# EAGLE design PCB-RPIBO1 (EAGLE 6.5.0)
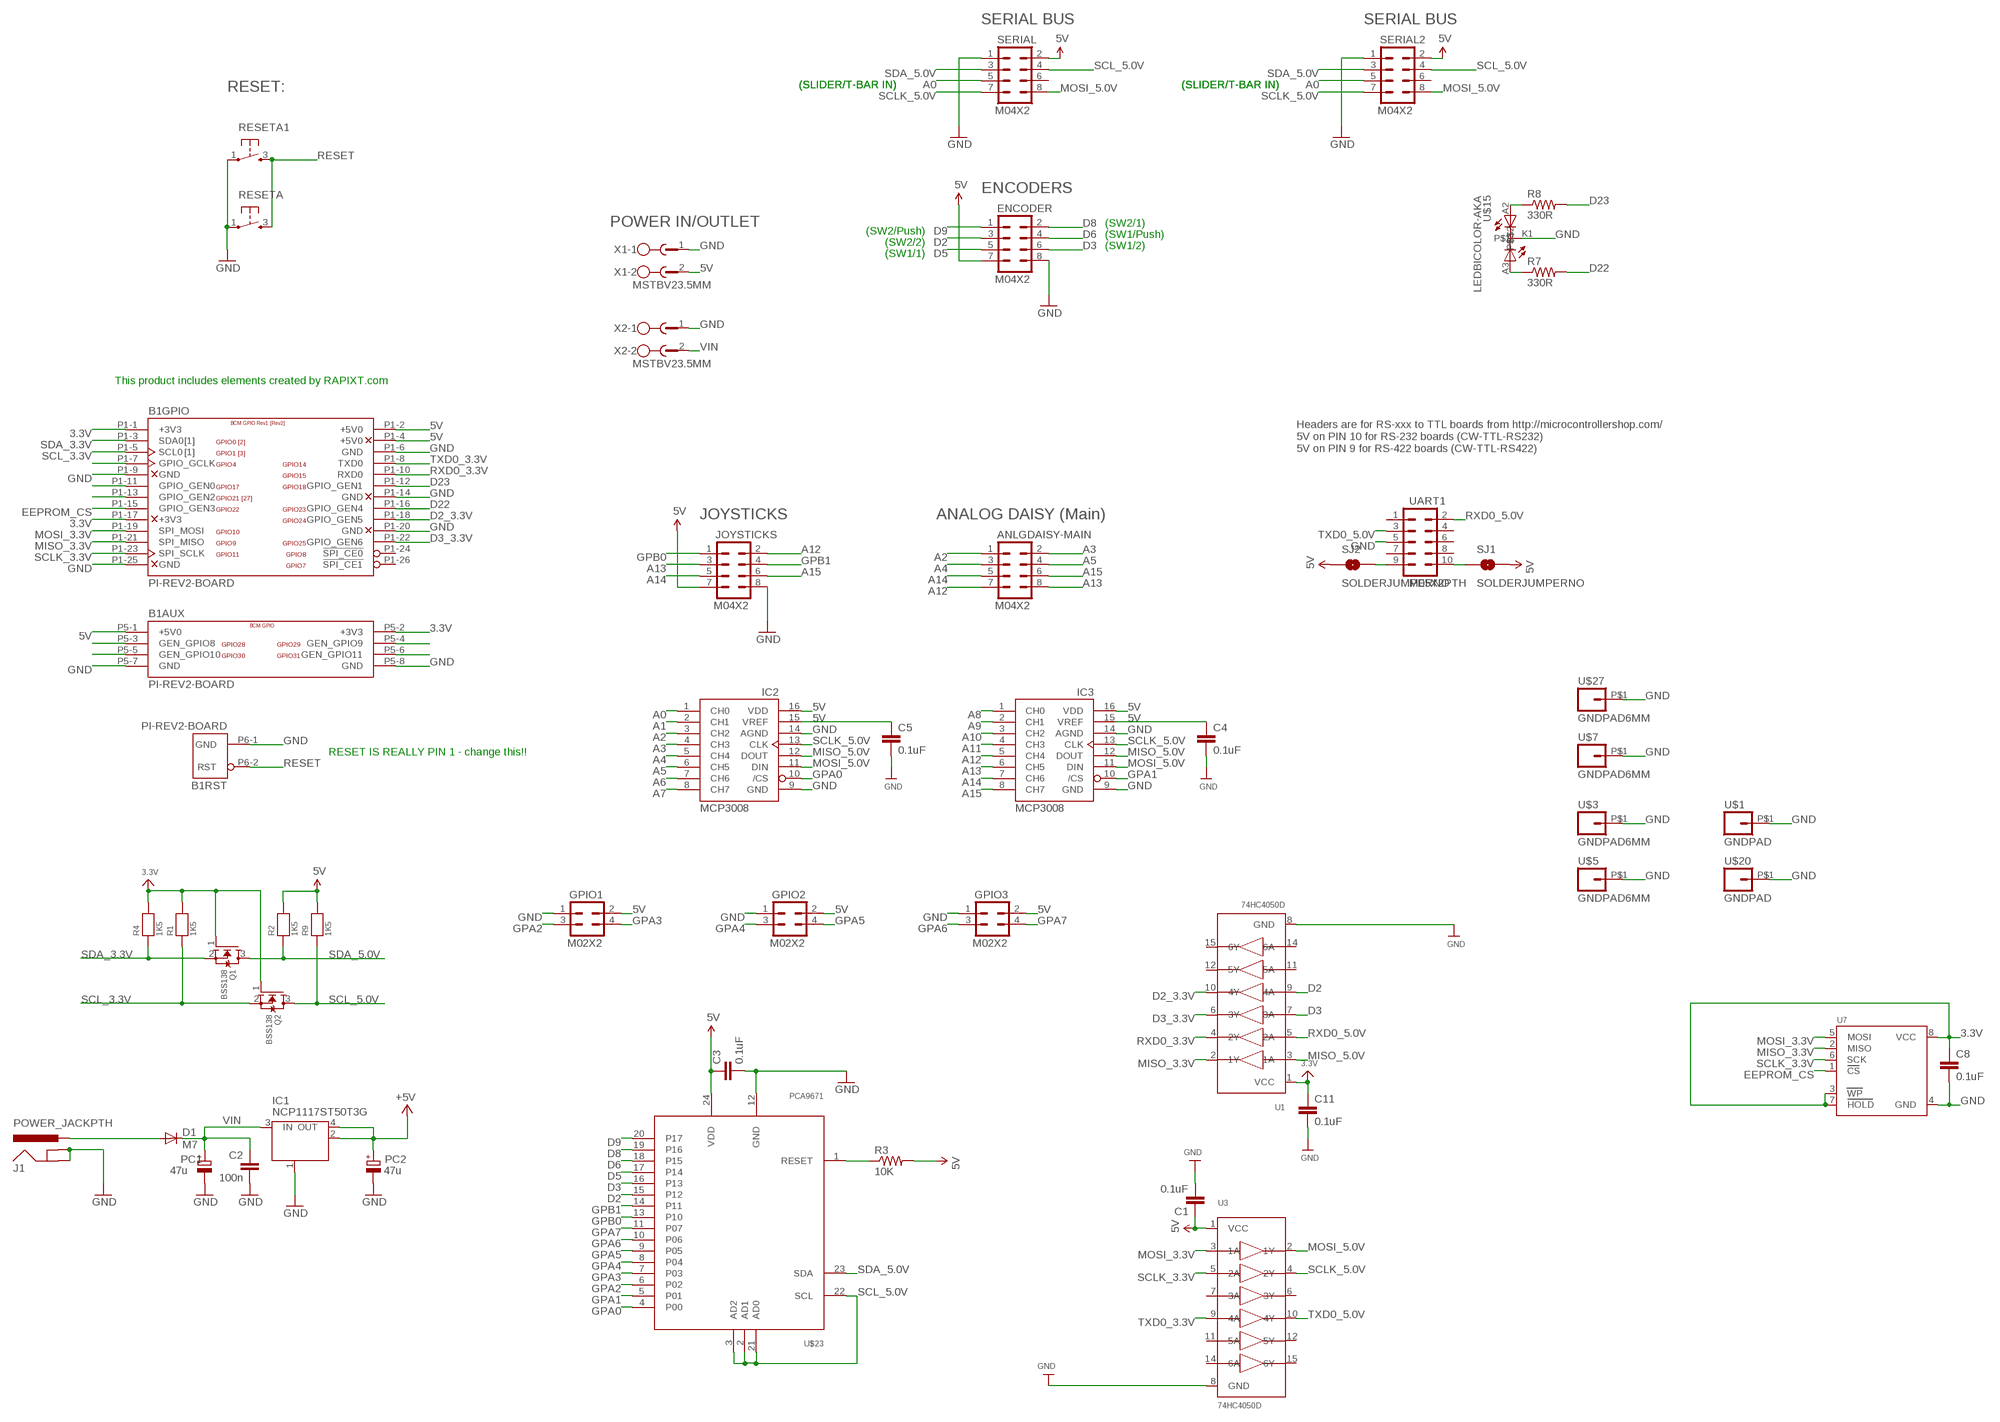
[diagram p0: schematic, sheet 1]

## Parts
ANLGDAISY-MAIN  M04X2  [2X4]
B1  PI-REV2-BOARD  [RASPBERRY-PI-REV2]
C1  0.1uF  CAP0603-CAP  [0603-CAP]
C2  100n  C-EU0603-RND  [C0603-ROUND]
C3  0.1uF  CAP0603-CAP  [0603-CAP]
C4  0.1uF  CAP0603-CAP  [0603-CAP]
C5  0.1uF  CAP0603-CAP  [0603-CAP]
C8  0.1uF  CAP0603-CAP  [0603-CAP]
C11  0.1uF  CAP0603-CAP  [0603-CAP]
D1  M7  DIODE-SMB  [SMB]
ENCODER  M04X2  [2X4]
GPIO1  M02X2  [2X2]
GPIO2  M02X2  [2X2]
GPIO3  M02X2  [2X2]
IC1  NCP1117ST50T3G  MC33269ST-3.3T3  [SOT223]
IC2  MCP3008SOIC  [SOIC16]
IC3  MCP3008SOIC  [SOIC16]
J1  POWER_JACKPTH  [POWER_JACK_PTH]
JOYSTICKS  M04X2  [2X4]
PC1  47u  CPOL-EUD  [PANASONIC_D]
PC2  47u  CPOL-EUD  [PANASONIC_D]
Q1  BSS138  MOSFET-NWIDE  [SOT23-WIDE]
Q2  BSS138  MOSFET-NWIDE  [SOT23-WIDE]
R1  1K5  RESISTOR0603  [0603]
R2  1K5  RESISTOR0603  [0603]
R3  10K  RESISTOR0603-RES  [0603-RES]
R4  1K5  RESISTOR0603  [0603]
R7  330R  RESISTOR0603-RES  [0603-RES]
R8  330R  RESISTOR0603-RES  [0603-RES]
R9  1K5  RESISTOR0603  [0603]
RESETA  TAC_SWITCH  [PUSHBUTTON]
RESETA1  TAC_SWITCH  [PUSHBUTTON]
SERIAL  M04X2  [2X4]
SERIAL2  M04X2  [2X4]
SJ1  SOLDERJUMPERNO  [SJ_2S-NO]
SJ2  SOLDERJUMPERNO  [SJ_2S-NO]
U1  74HC4050D  74HC4050DTSSOP16  [TSSOP16]
U3  74HC4050D  74HC4050DTSSOP16  [TSSOP16]
U7  EEPROM_SPI_AT25040ATSSOP  [TSSOP8-4.4MM]
U$1  GNDPAD  [3.2MMPAD]
U$3  GNDPAD6MM  [3.2MMPAD6MM]
U$5  GNDPAD6MM  [3.2MMPAD6MM]
U$7  GNDPAD6MM  [3.2MMPAD6MM]
U$15  LEDBICOLOR-AKA  [LED5MM-BICOLOR]
U$20  GNDPAD  [3.2MMPAD]
U$23  PCA9671  [TSSOP24]
U$27  GNDPAD6MM  [3.2MMPAD6MM]
UART1  M05X2PTH  [AVR_ICSP]
X1  MSTBV23.5MM  [MSTBV2-3.5]
X2  MSTBV23.5MM  [MSTBV2-3.5]

## Nets
3.3V [Power]: B1.P1-1(GPIO:+3V3) B1.P1-17(GPIO:+3V3) B1.P5-2(AUX:+3V3) C8.1 C11.1 Q1.1(G) Q2.1(G) R1.2 R4.2 U1.1(VCC) U7.3(WP) U7.7(HOLD) U7.8(VCC)
5V [Power]: B1.P1-2(GPIO:+5V0) B1.P1-4(GPIO:+5V0) B1.P5-1(AUX:+5V0) C1.1 C3.1 C4.1 C5.1 ENCODER.7 GPIO1.2 GPIO2.2 GPIO3.2 IC1.2(OUT) IC1.4(OUT) IC2.15(VREF) IC2.16(VDD) IC3.15(VREF) IC3.16(VDD) JOYSTICKS.7 PC2.+ R2.2 R3.2 R9.2 SERIAL2.2 SERIAL.2 SJ1.2 SJ2.1 U3.1(VCC) U$23.24(VDD) X1.2 ; supply symbol labelled +5V
12V [Power]: D1.A J1.PWR
A0: IC2.1(CH0) SERIAL2.5 SERIAL.5
A1: IC2.2(CH1)
A2: ANLGDAISY-MAIN.1 IC2.3(CH2)
A3: ANLGDAISY-MAIN.2 IC2.4(CH3)
A4: ANLGDAISY-MAIN.3 IC2.5(CH4)
A5: ANLGDAISY-MAIN.4 IC2.6(CH5)
A6: IC2.7(CH6)
A7: IC2.8(CH7)
A8: IC3.1(CH0)
A9: IC3.2(CH1)
A10: IC3.3(CH2)
A11: IC3.4(CH3)
A12: ANLGDAISY-MAIN.7 IC3.5(CH4) JOYSTICKS.2
A13: ANLGDAISY-MAIN.8 IC3.6(CH5) JOYSTICKS.3
A14: ANLGDAISY-MAIN.5 IC3.7(CH6) JOYSTICKS.5
A15: ANLGDAISY-MAIN.6 IC3.8(CH7) JOYSTICKS.6
D2: ENCODER.3 U1.9(4A) U$23.15(P12)
D2_3.3V: B1.P1-18(GPIO:GPIO_GEN5) U1.10(4Y)
D3: ENCODER.6 U1.7(3A) U$23.16(P13)
D3_3.3V: B1.P1-22(GPIO:GPIO_GEN6) U1.6(3Y)
D5: ENCODER.5 U$23.17(P14)
D6: ENCODER.4 U$23.18(P15)
D8: ENCODER.2 U$23.19(P16)
D9: ENCODER.1 U$23.20(P17)
D22: B1.P1-16(GPIO:GPIO_GEN4) R7.2
D23: B1.P1-12(GPIO:GPIO_GEN1) R8.2
EEPROM_CS: B1.P1-15(GPIO:GPIO_GEN3) U7.1(CS)
GND [Power]: B1.P1-6(GPIO:GND) B1.P1-9(GPIO:GND) B1.P1-14(GPIO:GND) B1.P1-20(GPIO:GND) B1.P1-25(GPIO:GND) B1.P5-7(AUX:GND) B1.P5-8(AUX:GND) B1.P6-1(RST:GND) C1.2 C2.2 C3.2 C4.2 C5.2 C8.2 C11.2 ENCODER.8 GPIO1.1 GPIO2.1 GPIO3.1 IC1.1(GND/ADJ) IC2.9(GND) IC2.14(AGND) IC3.9(GND) IC3.14(AGND) J1.GND J1.SHUNT(GNDBREAK) JOYSTICKS.8 PC1.- PC2.- RESETA1.1 RESETA.1 SERIAL2.1 SERIAL.1 U1.8(GND) U3.8(GND) U7.4(GND) U$1.P$1 U$3.P$1 U$5.P$1 U$7.P$1 U$15.K1 U$20.P$1 U$23.12(GND) U$27.P$1 UART1.5 X1.1 X2.1
GPA0: IC2.10(/CS) U$23.4(P00)
GPA1: IC3.10(/CS) U$23.5(P01)
GPA2: GPIO1.3 U$23.6(P02)
GPA3: GPIO1.4 U$23.7(P03)
GPA4: GPIO2.3 U$23.8(P04)
GPA5: GPIO2.4 U$23.9(P05)
GPA6: GPIO3.3 U$23.10(P06)
GPA7: GPIO3.4 U$23.11(P07)
GPB0: JOYSTICKS.1 U$23.13(P10)
GPB1: JOYSTICKS.4 U$23.14(P11)
MISO_3.3V: B1.P1-21(GPIO:SPI_MISO) U1.2(1Y) U7.2(MISO)
MISO_5.0V: IC2.12(DOUT) IC3.12(DOUT) U1.3(1A)
MOSI_3.3V: B1.P1-19(GPIO:SPI_MOSI) U3.3(1A) U7.5(MOSI)
MOSI_5.0V: IC2.11(DIN) IC3.11(DIN) SERIAL2.8 SERIAL.8 U3.2(1Y)
N$1: R3.1 U$23.1(RESET)
N$9: SJ2.2 UART1.9
N$10: SJ1.1 UART1.10
N$17: R8.1 U$15.A2
N$22: R7.1 U$15.A3
N$24: B1.P1-13(GPIO:GPIO_GEN2)
N$25: B1.P1-11(GPIO:GPIO_GEN0)
N$27: B1.P1-7(GPIO:GPIO_GCLK)
N$34: B1.P5-4(AUX:GEN_GPIO9)
N$35: B1.P5-6(AUX:GEN_GPIO11)
N$38: B1.P5-3(AUX:GEN_GPIO8)
N$39: B1.P5-5(AUX:GEN_GPIO10)
RESET: B1.P6-2(RST:RST) RESETA1.3 RESETA.3
RXD0_3.3V: B1.P1-10(GPIO:RXD0) U1.4(2Y)
RXD0_5.0V: U1.5(2A) UART1.2
SCL_3.3V: B1.P1-5(GPIO:SCL0) Q2.2(S) R1.1
SCL_5.0V: Q2.3(D) R9.1 SERIAL2.4 SERIAL.4 U$23.2(AD1) U$23.3(AD2) U$23.21(AD0) U$23.22(SCL)
SCLK_3.3V: B1.P1-23(GPIO:SPI_SCLK) U3.5(2A) U7.6(SCK)
SCLK_5.0V: IC2.13(CLK) IC3.13(CLK) SERIAL2.7 SERIAL.7 U3.4(2Y)
SDA_3.3V: B1.P1-3(GPIO:SDA0) Q1.2(S) R4.1
SDA_5.0V: Q1.3(D) R2.1 SERIAL2.3 SERIAL.3 U$23.23(SDA)
TXD0_3.3V: B1.P1-8(GPIO:TXD0) U3.9(4A)
TXD0_5.0V: U3.10(4Y) UART1.3
VIN [Power]: C2.1 D1.C IC1.3(IN) PC1.+ X2.2
Unconnected: B1.P1-24(GPIO:!SPI_CE0) B1.P1-26(GPIO:!SPI_CE1) SERIAL2.6 SERIAL.6 U1.11(5A) U1.12(5Y) U1.14(6A) U1.15(6Y) U3.6(3Y) U3.7(3A) U3.11(5A) U3.12(5Y) U3.14(6A) U3.15(6Y) UART1.1 UART1.4 UART1.6 UART1.7 UART1.8

## Notes on the sheet
- SERIAL BUS | SERIAL BUS
- (SLIDER/T-BAR IN) | (SLIDER/T-BAR IN) | (SLIDER/T-BAR IN) | (SLIDER/T-BAR IN)
- RESET:
- ENCODERS
- POWER IN/OUTLET | (SW2/Push) | (SW2/1)
- (SW2/2) | (SW1/Push)
- (SW1/1) | (SW1/2)
- This product includes elements created by RAPIXT.com
- Headers are for RS-xxx to TTL boards from http://microcontrollershop.com/
  5V on PIN 10 for RS-232 boards (CW-TTL-RS232)
  5V on PIN 9 for RS-422 boards (CW-TTL-RS422)
- JOYSTICKS | ANALOG DAISY (Main)
- RESET IS REALLY PIN 1 - change this!!

## Library data of the parts
ANLGDAISY-MAIN ENCODER JOYSTICKS SERIAL SERIAL2 = SparkFun:M04X2
B1 = SKAARHOJ:PI-REV2-: Raspberry Pi Rev2
C1 C3-C5 C8 C11 = SparkFun:CAP: Capacitor Standard 0603 ceramic capacitor, and 0.1" leaded capacitor.
C2 = SmartPrj:C-EU: CAPACITOR, European symbol
D1 = diode:DIODE-: DIODE
GPIO1-GPIO3 = SKAARHOJ:M02X2
IC1 = linear:MC33269ST*: Adjustable Output Low Dropout Voltage Regulator 800 mA Source: http://www.onsemi.com/pub/Collateral/MC33269-D.PDF
IC2 IC3 = SKAARHOJ:MCP3008
J1 = SKAARHOJ:POWER_JACK: RASM712PX Right Angle SMT Mount DC Power Jack, pin size 0.100"(2.5mm), with locating post Switchcraft.com
PC1 PC2 = rcl:CPOL-EU: POLARIZED CAPACITOR, European symbol
Q1 Q2 = microbuilder:MOSFET-N: N-Channel Mosfet LEGEND VDS: Voltage Drain-Source ID: Drain Current RDS(ON): Drain-Source On-State Resistance VGS(TH): Gate-Source Threshold Voltage CISS: Drain-Source Input Capacitance SOT-23 Name VDS ID RDS(ON) VGS(TH) CISS Order Number 2N7002E 60V 260mA 2.5 Ohm 2.5V @ 250uA 26.7pF @ 25V 2N7002ET1GOSTR-ND BSH103 30V 850mA 400 mOhm 400mV @ 1mA 83pF @ 24V BSH103,235-ND BSS138 60V 320mA 1.6 Ohm 1.5V @ 250uA 50pF @ 10V Mouser: 771-BSS138PW115 DMN2075U-7 20V 4.2A 38 mOhm 1V @ 250 uA 594.3pF @ 10V DMN2075U-7DICT-ND * BSS138 good choice for I2C level-shifting
R1 R2 R4 R9 = microbuilder:RESISTOR: Resistors 0402 - 0402 Surface Mount Package 22 Ohm 1% 1/16W [Digikey: 311-22.0LRTR-ND] 33 Ohm 5% 1/16W 1.0K 5% 1/16W 1.5K 5% 1/16W 2.0K 1% 1/16W 10.0K 1% 1/16W [Digikey: 311-10.0KLRTR-ND] 10.0K 5% 1/16W [Digikey: RMCF0402JT10K0TR-ND] 12.1K 1% 1/16W [Digikey: 311-22.0LRTR-ND] 100.0K 5% 1/16W 0603 - 0603 Surface Mount Package 0 Ohm 1/10 Watt 1% Resistor 15 Ohm 1/10 Watt 1% Resistor 33 Ohm 1/10 Watt 1% Resistor 49.9 Ohm 1/10 Watt 1% Resistor 100 Ohm 1/10 Watt 1% Resistor 150 Ohm 1/10 Watt 1% Resistor 240 Ohm 1/10 Watt 1% Resistor 390 Ohm 1/10 Watt 1% Resistor 560 Ohm 1/10 Watt 1% Resistor 680 Ohm 1/10 Watt 1% Resistor 750 Ohm 1/10 Watt 1% Resistor 1.0K Ohm 1/10 Watt 1% Resistor 1.5K Ohm 1/10 Watt 1% Resistor 2.0K Ohm 1/10 Watt 1% Resistor 2.2K Ohm 1/10 Watt 1% Resistor 3.3K Ohm 1/10 Watt 1% Resistor 4.7K Ohm 1/10 Watt 1% Resistor 10.0K Ohm 1/10 Watt 1% Resistor 12.0K Ohm 1/10 Watt 1% Resistor 12.1K Ohm 1/10 Watt 1% Resistor 20.0K Ohm 1/10 Watt 1% Resistor 33.0K Ohm 1/10 Watt 1% Resistor 100.0K Ohm 1/10 Watt 1% Resistor 0805 - 0805 Surface Mount Package 0 Ohm 1/8 Watt 1% Resistor 33 Ohm 1/8 Watt 1% Resistor 100 Ohm 1/8 Watt 1% Resistor 150 Ohm 1/8 Watt 1% Resistor 200 Ohm 1/8 Watt 1% Resistor 240 Ohm 1/8 Watt 1% Resistor 330 Ohm 1/8 Watt 1% Resistor 390 Ohm 1/8 Watt 1% Resistor 470 Ohm 1/8 Watt 1% Resistor 1.0K Ohm 1/8 Watt 1% Resistor 1.5K Ohm 1/8 Watt 1% Resistor 2.0K Ohm 1/8 Watt 1% Resistor 4.7K Ohm 1/8 Watt 1% Resistor 5.1K Ohm 1/8 Watt 1% Resistor 5.6K Ohm 1/8 Watt 1% Resistor 10.0K Ohm 1/8 Watt 1% Resistor 22.0K Ohm 1/8 Watt 1% Resistor 33.0K Ohm 1/8 Watt 1% Resistor 100K Ohm 1/8 Watt 1% Resistor 1206 - 1206 Surface Mount Package 2012 - 2010 Surface Mount Package 0.11 Ohm 1/2 Watt 1% Resistor - Digikey: RHM.11UCT-ND
R3 R7 R8 = SparkFun:RESISTOR: Resistor Basic schematic elements and footprints for 0603, 1206, and PTH resistors.
RESETA RESETA1 = SKAARHOJ:TAC_SWITCH: Momentary Switch Button commonly used for reset or general input. Spark Fun Electronics SKU : COM-00097
SJ1 SJ2 = SparkFun:SOLDERJUMPER: Solder Jumper Standard SMD solder jumper. Used to automate production. Two varients : Normally Open and Normally Closed are the same, but have different paste layers. NC will have a large amount of paste and should jumper during reflow.
U1 U3 = SKAARHOJ:74HC4050D: 6-channel level shifter 74HC4050D - 2V-6V Supply Digikey: 74HC4050D,653-ND Mouser: 771-74HC4050D-T
U7 = microbuilder:EEPROM_SPI_AT25040A: AT25010a/40a EEPROM SOIC8 AT25010a, 1K (128 x 8 bit) - Digikey: AT25010AN-10SU2.7-ND AT25040a, 4K (256 x 8 bit) - Digikey: AT25040AN-10SU1.8-ND TSSOP8 AT25010a, 1K (128 x 8 bit) - Digikey: AT25010A-10TU-1.8-ND AT25040a, 4K (256 x 8 bit) - Digikey: AT25040A-10TU-1.8-ND
U$1 U$3 U$5 U$7 U$20 U$27 = SKAARHOJ:GNDPAD
U$15 = SKAARHOJ:LEDBICOLOR-AKA
U$23 = SKAARHOJ:PCA9671
UART1 = SparkFun:M05X2: Header 5x2 Standard 10-pin dual row 0.1" header. Commonly used with AVR-ISP. Use with Spark Fun Electronics SKU: PRT-00778
X1 X2 = SKAARHOJ:MSTBV2: PHOENIX

## Net classes
0 default: width 0.203 mm, drill 0.406 mm, clearance 0.152 mm
1 Power: width 0.508 mm, drill 0.61 mm, clearance 0.203 mm
3 INput lines: clearance 0.203 mm

## Board
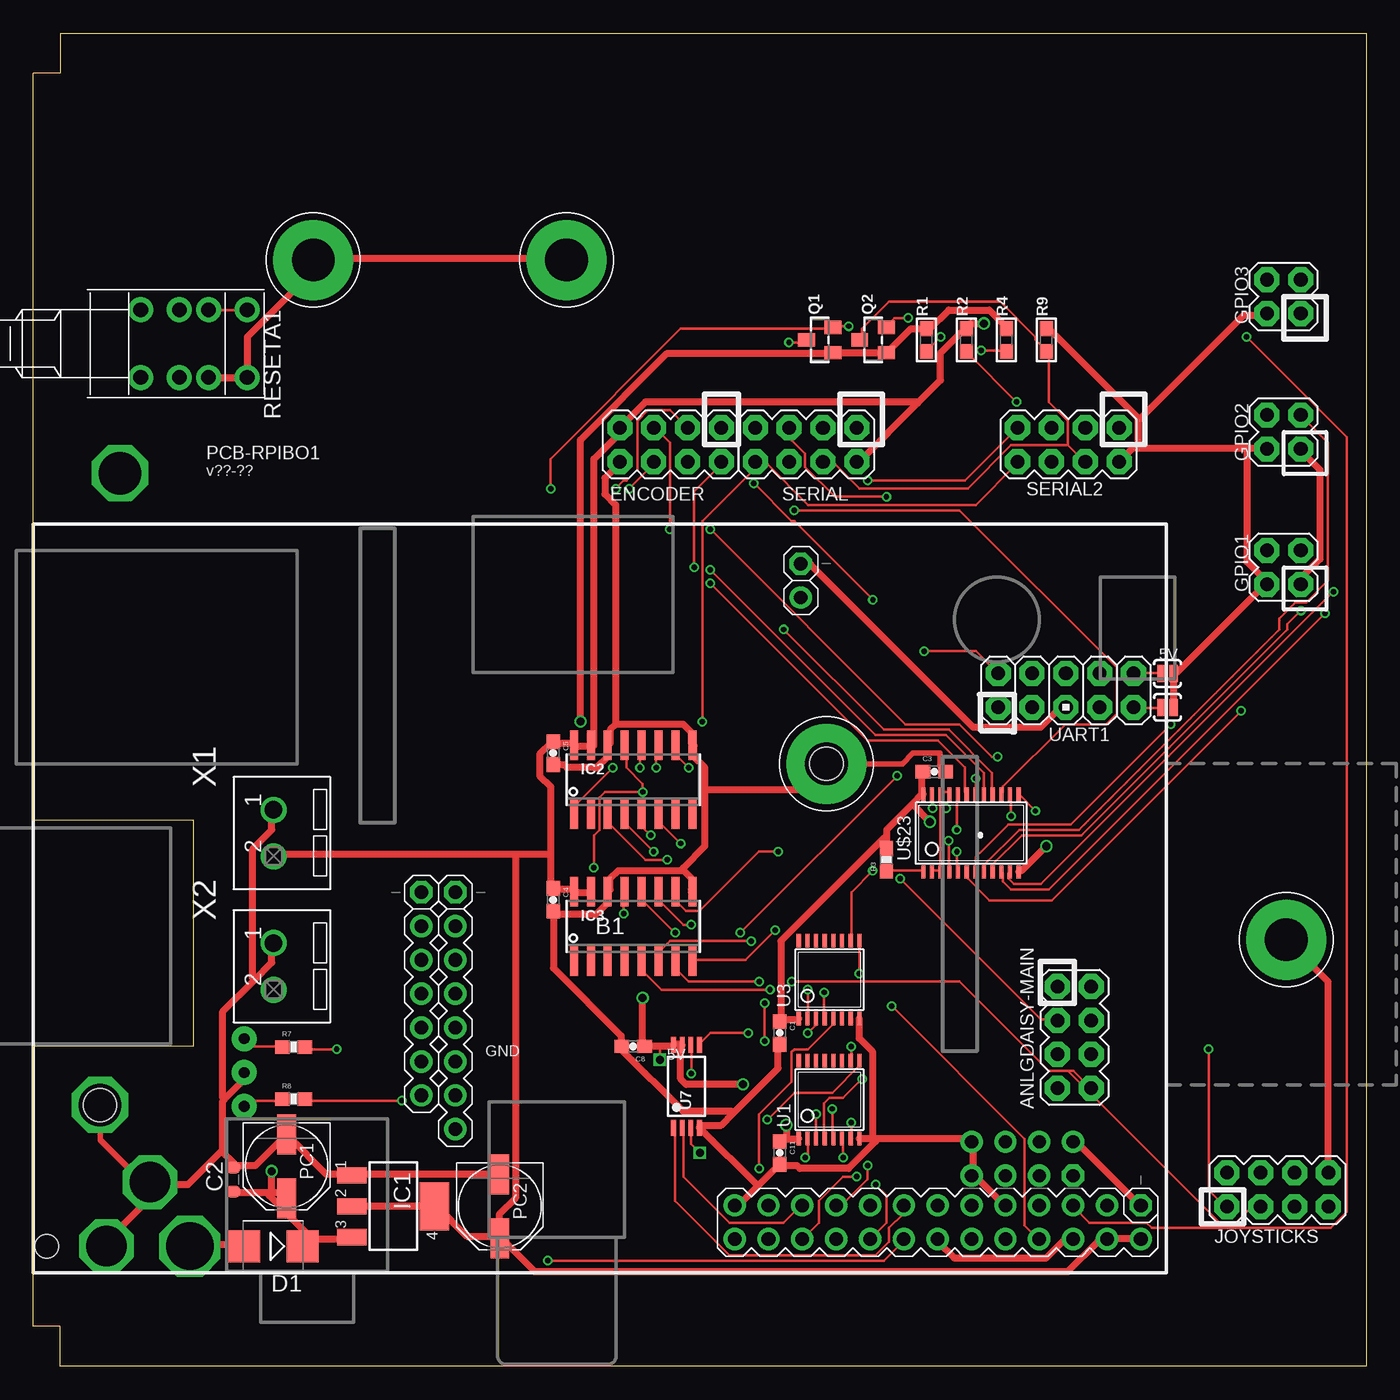
[diagram p1: board, top side]
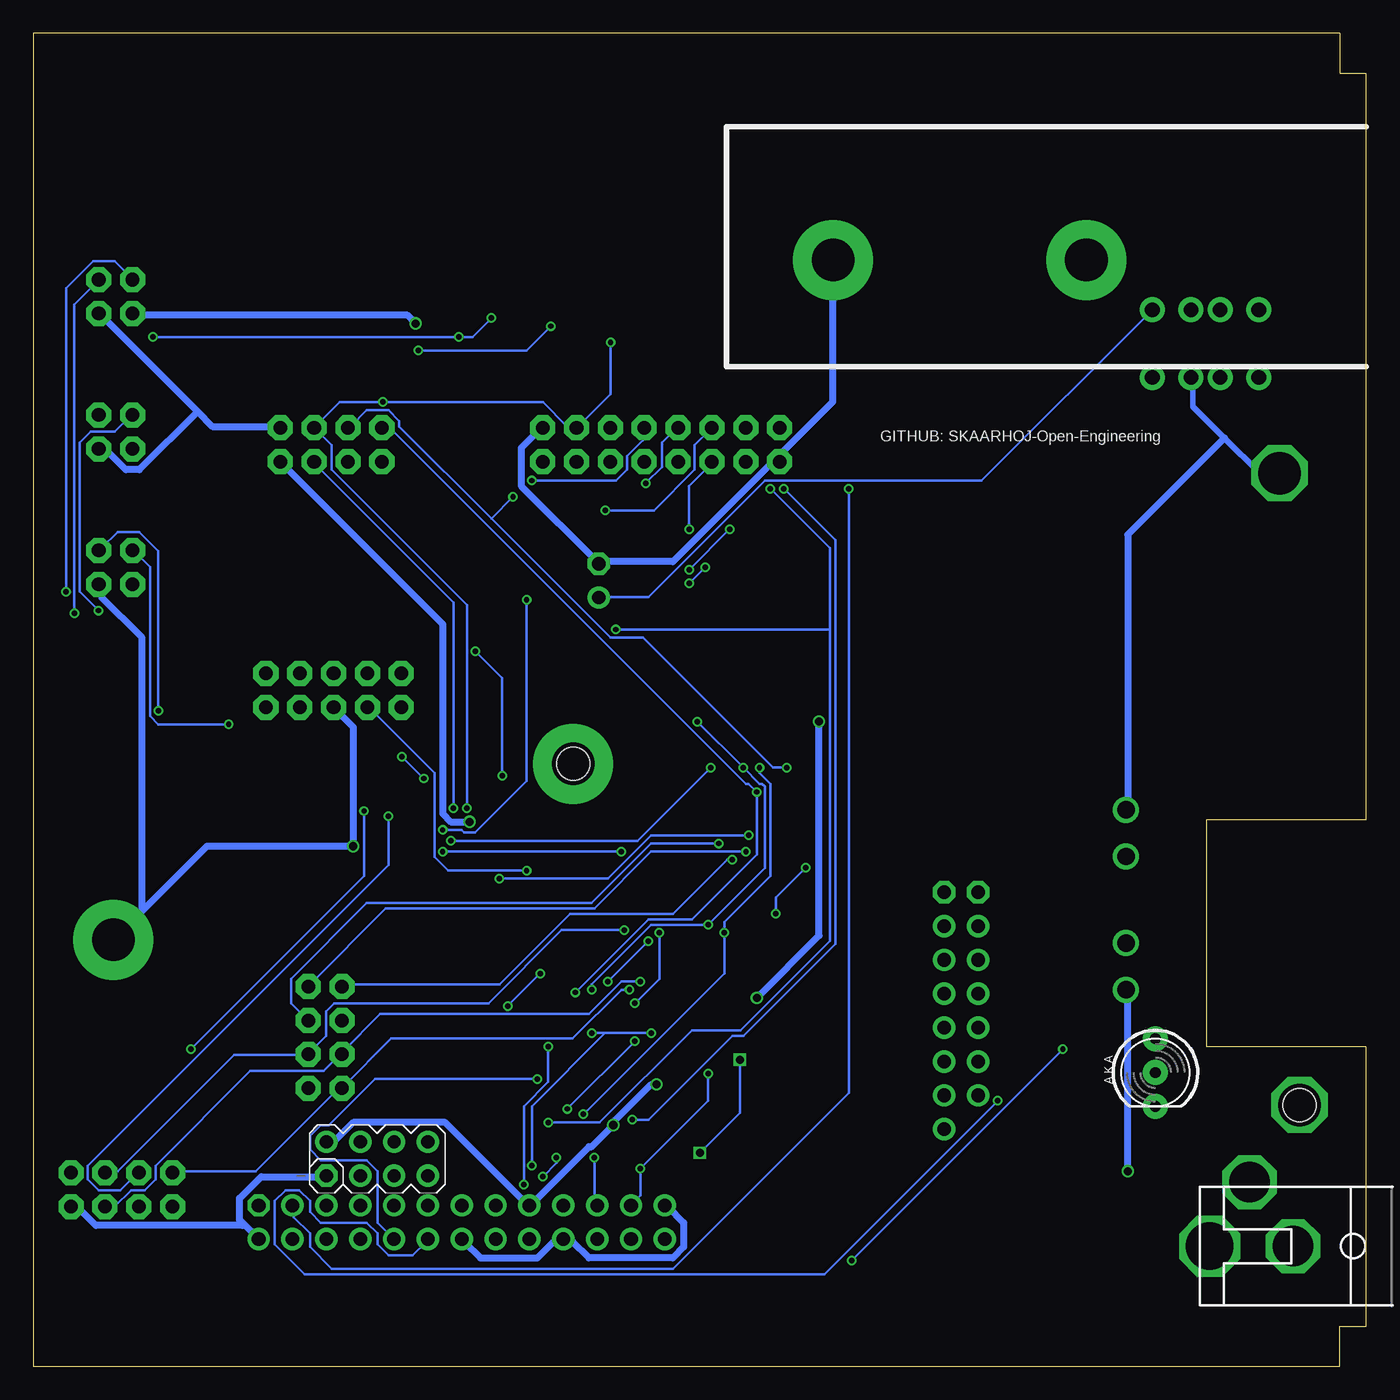
[diagram p2: board, bottom side, seen from below]

Size 100 x 100 mm. Coordinates in mm from the lower left corner, seen from the top.
Outline: 0,3 0,24 12,24 12,41 0,41 0,97 2,97 2,100 100,100 100,0 2,0 2,3 0,3
Copper layers (1*16): Top 0.035mm / dielectric 1.5mm / Bottom 0.035mm
Design rules "Fusion_eagle_rule_v1.1": minimum track width 6mil, minimum drill 12mil, track to track 6mil, track to pad 6mil, pad to pad 6mil, via to via 6mil, smd to smd 0mil, copper to edge 10mil, drill to drill 10mil, minimum pad ring 10mil, minimum via ring 6mil, stop-mask expansion 2mil, vias tented up to drill 100mil, thermal gap 10mil
tRestrict: area 0,14 to 10.5,25; area 0,61.5 to 10.5,72.5; area 0,94 to 100,100; area 0,0 to 100,6
bRestrict: area 0,61.5 to 10.5,72.5; area 0,14 to 10.5,25; area 0,0 to 100,2.5; area 0,97.5 to 100,100

### Footprints (pad centres in the part's own frame; a part is rotated, then mirrored left to right if it is on the bottom)
2X4 = drill 1.016 pad 1.88 octagon: 1 -3.81,-1.27; 2 -3.81,1.27; 3 -1.27,-1.27; 4 -1.27,1.27; 5 1.27,-1.27; 6 1.27,1.27; 7 3.81,-1.27; 8 3.81,1.27
RASPBERRY-PI-REV2 = drill 1.016 pad 1.676 octagon: P1-1 83.095,5.065; P2-1 31.66,28.56; P3-1 29.12,28.56 | drill 1.016 pad 1.676: P1-2 83.095,2.525; P1-3 80.555,5.065; P1-4 80.555,2.525; P1-5 78.015,5.065; P1-6 78.015,2.525; P1-7 75.475,5.065; P1-8 75.475,2.525; P1-9 72.935,5.065; P1-10 72.935,2.525; P1-11 70.395,5.065; P1-12 70.395,2.525; P1-13 67.855,5.065; P1-14 67.855,2.525; P1-15 65.315,5.065; P1-16 65.315,2.525; P1-17 62.775,5.065; P1-18 62.775,2.525; P1-19 60.235,5.065; P1-20 60.235,2.525; P1-21 57.695,5.065; P1-22 57.695,2.525; P1-23 55.155,5.065; P1-24 55.155,2.525; P1-25 52.615,5.065; P1-26 52.615,2.525; P2-2 31.66,26.02; P2-3 31.66,23.48; P2-4 31.66,20.94; P2-5 31.66,18.4; P2-6 31.66,15.86; P2-7 31.66,13.32; P2-8 31.66,10.78; P3-2 29.12,26.02; P3-3 29.12,23.48; P3-4 29.12,20.94; P3-5 29.12,18.4; P3-6 29.12,15.86; P3-7 29.12,13.32 | drill 1 pad 1.676 octagon: P5-1 78.015,7.287; P6-1 57.58,53.21 | drill 1 pad 1.676: P5-2 78.015,9.828; P5-3 75.475,7.287; P5-4 75.475,9.828; P5-5 72.935,7.287; P5-6 72.935,9.828; P5-7 70.395,7.287; P5-8 70.395,9.828; P6-2 57.58,50.67 | hole 2.5: 59.5,38.2; 5,12.6
0603-CAP = smd 1.1 x 1: 1 -0.85,0; 2 0.85,0
C0603-ROUND = smd 0.898 x 1.1: 1 -0.889,0; 2 0.889,0
SMB = smd 2.4 x 2.4: A 2.2,0; C -2.2,0
2X2 = drill 1.016 pad 1.88 octagon: 1 -3.81,-1.27; 2 -3.81,1.27; 3 -1.27,-1.27; 4 -1.27,1.27
SOT223 = smd 1.219 x 2.235: 1 -2.311,-3.099; 2 0,-3.099; 3 2.311,-3.099 | smd 3.6 x 2.2: 4 0,3.099
SOIC16 = smd 0.6 x 2.2: 1 -4.445,-2.6; 2 -3.175,-2.6; 3 -1.905,-2.6; 4 -0.635,-2.6; 5 0.635,-2.6; 6 1.905,-2.6; 7 3.175,-2.6; 8 4.445,-2.6; 9 4.445,2.6; 10 3.175,2.6; 11 1.905,2.6; 12 0.635,2.6; 13 -0.635,2.6; 14 -1.905,2.6; 15 -3.175,2.6; 16 -4.445,2.6
POWER_JACK_PTH = drill 3.048 octagon: GND -7.493,0; SHUNT -10.744,4.801 | drill 3.556 octagon: PWR -13.741,0 | hole 1.778: -2.997,0
PANASONIC_D = smd 3 x 1.4: + 2.4,0; - -2.4,0
SOT23-WIDE = smd 1 x 1.27: 1 -0.95,-1; 2 0.95,-1; 3 0,1
0603 = smd 1.1 x 1: 1 -0.85,0; 2 0.85,0
0603-RES = smd 1.1 x 1: 1 -0.85,0; 2 0.85,0
PUSHBUTTON = drill 1.1 pad 1.88: 1 2.54,2.54; 2 2.54,-2.54; 3 -2.54,2.54; 4 -2.54,-2.54
SJ_2S-NO = smd 0.635 x 1.27: 1 -0.45,0; 2 0.45,0
TSSOP16 = smd 0.305 x 0.991: 1 -3.575,-2.918; 2 -2.925,-2.918; 3 -2.275,-2.918; 4 -1.625,-2.918; 5 -0.975,-2.918; 6 -0.325,-2.918; 7 0.325,-2.918; 8 0.975,-2.918; 9 0.975,2.918; 10 0.325,2.918; 11 -0.325,2.918; 12 -0.975,2.918; 13 -1.625,2.918; 14 -2.275,2.918; 15 -2.925,2.918; 16 -3.575,2.918
TSSOP8-4.4MM = smd 1.2 x 0.35: 1 -3.1,0.975; 2 -3.1,0.325; 3 -3.1,-0.325; 4 -3.1,-0.975; 5 3.1,-0.975; 6 3.1,-0.325; 7 3.1,0.325; 8 3.1,0.975
3.2MMPAD = drill 3.2 octagon: P$1 0,0
3.2MMPAD6MM = drill 3.2 pad 6: P$1 0,0
LED5MM-BICOLOR = drill 0.813 pad 1.88: A2 2.54,0; A3 -2.54,0; K1 0,0
TSSOP24 = smd 0.305 x 0.991: 1 -4.225,-2.918; 2 -3.575,-2.918; 3 -2.925,-2.918; 4 -2.275,-2.918; 5 -1.625,-2.918; 6 -0.975,-2.918; 7 -0.325,-2.918; 8 0.325,-2.918; 9 0.975,-2.918; 10 1.625,-2.918; 11 2.275,-2.918; 12 2.925,-2.918; 13 2.925,2.918; 14 2.275,2.918; 15 1.625,2.918; 16 0.975,2.918; 17 0.325,2.918; 18 -0.325,2.918; 19 -0.975,2.918; 20 -1.625,2.918; 21 -2.275,2.918; 22 -2.925,2.918; 23 -3.575,2.918; 24 -4.225,2.918
AVR_ICSP = drill 1.016 pad 1.88 octagon: 1 -1.27,5.08; 2 1.27,5.08; 3 -1.27,2.54; 4 1.27,2.54; 5 -1.27,0; 6 1.27,0; 7 -1.27,-2.54; 8 1.27,-2.54; 9 -1.27,-5.08; 10 1.27,-5.08
MSTBV2-3.5 = drill 1.3: 1 -1.75,0.02; 2 1.75,0.02

### Placement (x,y rotation side)
ANLGDAISY-MAIN  78.11,24.67 270 top
B1  0,7 0 top
C1  56,25 270 top
C2  15,14 90 top
C3  67.6,44.6 0 top
C4  39,35 270 top
C5  39,46 270 top
C8  45,24 180 top
C11  56,16 270 top
D1  18,9 180 top
ENCODER  47.81,69.14 180 top
GPIO1  93.83,62.47 90 top
GPIO2  93.83,72.63 90 top
GPIO3  93.83,82.79 90 top
IC1  27,12 270 top
IC2  45,44 0 top
IC3  45,33 0 top
J1  -2,9 0 bottom
JOYSTICKS  93.36,13.24 0 top
PC1  19,15 270 top
PC2  35,12 270 top
Q1  59,77 90 top
Q2  63,77 90 top
R1  67,77 90 top
R2  70,77 90 top
R3  64,38 90 top
R4  73,77 90 top
R7  19.52,23.95 0 top
R8  19.52,20.05 0 top
R9  76,77 90 top
RESETA  10.6,76.72 270 top
RESETA1  13.5,76.72 270 top
SERIAL  57.98,69.14 180 top
SERIAL2  77.66,69.14 180 top
SJ1  85.09,51.98 0 top
SJ2  85.09,49.44 180 top
U1  61,20 0 top
U3  61,29 0 top
U7  49,21 90 top
U$1  6.5,67 0 top
U$3  21,83 0 top
U$5  40,83 0 top
U$7  94,32 0 top
U$15  15.81,22.03 270 bottom
U$20  5,19.6 0 top
U$23  71,40 0 top
U$27  59.5,45.2 0 top
UART1  77.47,50.7 90 top
X1  18,40 270 top
X2  18,30 270 top

### Tracks (layer width: path | path; a pad name or v marks a point on that pad's centre or on a via)
3.3V  (via drill 0.6, 0.61)
  Top 0.203: U7.3 49.33,16.68 v50,16 | v47,23 47,23.98
  Top 0.508: B1.P5-2 78.03,16.66 78.44,16.66 82.91,12.19 B1.P1-1 | R4.2 72.95,78.03 71.73,79.25 68.68,79.25 67.26,77.83 R1.2 66.85,77.83 65.84,77.83 64.01,76 Q2.1 63.8,76 60.15,76 Q1.1 59.94,76 47.55,76 41.05,69.49 v41.05,48.36 | U1.1 57.3,17.07 56.29,17.07 56.08,16.87 C11.1 56.49,17.27 v56.49,18.09 | v53.24,21.13 48.97,21.13 48.56,21.54 48.56,23.98 U7.7 48.56,24.18 48.16,24.18 U7.8 47.95,23.98 47,23.98 45.92,23.98 C8.1 45.72,24.18 v45.72,27.64
  Bottom 0.203: v50,16 47,19 v47,23
  Bottom 0.508: v53.24,21.13 53.65,21.13 56.49,18.29 v56.49,18.09 58.12,16.46 58.32,16.46 62.59,12.19 B1.P1-17 62.99,12.19 69.09,18.29 76,18.29 77.42,16.87 77.83,16.87 B1.P5-2 | v41.05,48.36 41.05,32.31 v45.72,27.64
5V  (via drill 0.61)
  Top 0.508: U3.1 57.3,26.01 56.08,26.01 C1.1 56.08,26.21 56.08,31.9 63.8,39.62 64.01,39.62 | C3.1 66.65,44.5 66.65,43.08 U$23.24 66.65,42.88 65.94,42.16 | 64.01,39.62 64.01,40.23 65.94,42.16 | 64.01,39.62 64.01,39.01 R3.2 | SJ2.1 85.55,49.58 85.55,51.82 SJ1.2 85.75,52.02 92.46,58.73 GPIO1.2 92.46,58.93 91.03,60.35 91.03,68.89 | 82.91,71.12 76.2,77.83 R9.2 | 82.91,71.12 82.91,69.29 82.6,68.99 | 82.6,68.99 81.48,67.87 SERIAL2.2 | 91.03,68.89 82.7,68.89 82.6,68.99 | 91.03,68.89 92.46,68.89 GPIO2.2 | GPIO3.2 92.46,78.84 90.83,78.84 83.11,71.12 82.91,71.12 | v67.26,40.84 65.94,42.16 | 66.34,72.24 61.98,67.87 SERIAL.2 | 66.34,72.24 68.07,73.97 68.07,76 69.9,77.83 R2.2 70.1,78.03 70.31,78.23 v71.32,78.23 | 66.34,72.24 66.24,72.34 45.92,72.34 44.09,70.51 ENCODER.7 43.89,70.31 43.89,69.9 42.06,68.07 42.06,46.53 IC2.15 41.66,46.53 40.64,46.53 IC2.16 40.44,46.74 39.01,46.74 C5.1 38.81,46.74 38,45.92 38,44.3 38.81,43.48 38.81,38.41 | B1.P1-2 82.91,9.55 80.67,9.55 B1.P1-4 80.47,9.35 79.86,9.35 77.62,7.11 37.59,7.11 35.15,9.55 PC2.+ | IC1.2 23.98,11.99 30.07,11.99 IC1.4 30.28,11.99 32.51,9.75 34.95,9.75 PC2.+ | IC3.15 41.66,35.56 40.64,35.56 IC3.16 40.44,35.76 39.01,35.76 C4.1 38.81,35.97 38.81,38.41 | 38.81,38.41 36.17,38.41 | 36.17,38.41 18.09,38.41 X1.2 | 36.17,38.41 36.17,12.6 34.95,11.38 34.95,9.96 PC2.+
  Bottom 0.508: v67.26,40.84 68.68,40.84 69.29,41.45 69.29,55.68 81.28,67.67 SERIAL2.2 | 84.23,10.67 83.11,9.55 B1.P1-2 | 84.23,10.67 84.53,10.97 84.53,12.6 82.91,14.22 78.03,14.22 B1.P5-1 | JOYSTICKS.7 97.13,11.79 96.52,11.79 95.3,10.57 84.33,10.57 84.23,10.67 | v71.32,78.23 71.93,78.84 92.46,78.84 GPIO3.2
12V
  Top 0.508: D1.A 15.65,9.14 11.79,9.14 J1.PWR
A0  (via drill 0.41)
  Top 0.203: v43.48,44.91 40.64,42.06 40.64,41.45 IC2.1 | v64.01,65.23 60.15,65.23 57.91,67.46 57.91,68.48 56.9,69.49 56.9,70.31 SERIAL.5
  Bottom 0.203: v43.48,44.91 44.5,44.91 54.25,54.66 56.69,54.66 65.63,63.6 | 65.63,63.6 72.54,70.51 72.54,70.92 73.36,71.73 74.98,71.73 76.2,70.51 SERIAL2.5 | 65.63,63.6 v64.01,65.23
A2  (via drill 0.41)
  Top 0.203: v47.55,38 45.92,38 43.28,40.64 43.28,41.25 IC2.3
  Bottom 0.203: v47.55,38 47.95,38 52.02,33.93 59.74,33.93 65.02,28.65 76.81,28.65 ANLGDAISY-MAIN.1
A3  (via drill 0.41)
  Top 0.203: v46.53,38.61 44.5,40.64 44.5,41.25 IC2.4
  Bottom 0.203: v46.53,38.61 53.65,38.61 57.91,34.34 73.56,34.34 79.25,28.65 ANLGDAISY-MAIN.2
A4  (via drill 0.41)
  Top 0.203: v46.33,39.83 45.72,40.44 45.72,41.25 IC2.5 | v65.02,36.58 75.59,26.01 76.81,26.01 ANLGDAISY-MAIN.3
  Bottom 0.203: v46.33,39.83 53.65,39.83 56.9,36.58 v65.02,36.58
A5  (via drill 0.41)
  Top 0.203: v48.56,39.22 46.94,40.84 46.94,41.25 IC2.6
  Bottom 0.203: v48.56,39.22 53.65,39.22 58.12,34.75 74.98,34.75 80.67,29.06 80.67,27.23 79.45,26.01 ANLGDAISY-MAIN.4
A12  (via drill 0.41)
  Top 0.203: v55.27,28.25 47.14,28.25 45.72,29.67 45.72,30.28 IC3.5
  Bottom 0.203: v55.27,28.25 55.88,28.25 59.54,24.59 73.15,24.59 76.81,20.93 ANLGDAISY-MAIN.7 77.01,20.93 83.31,14.63 89.41,14.63 JOYSTICKS.2
A13  (via drill 0.41)
  Top 0.203: v53.85,31.9 47.75,31.9 46.94,31.09 46.94,30.48 IC3.6 | v56.9,28.85 69.49,28.85 76.2,22.15 77.62,22.15 | 77.62,22.15 78.03,22.15 79.25,20.93 ANLGDAISY-MAIN.8 | 77.62,22.15 89,10.77 90.22,10.77 91.24,11.79 92.05,11.79 JOYSTICKS.3
  Bottom 0.203: v56.9,28.85 v53.85,31.9
A14  (via drill 0.41)
  Top 0.203: v54.46,28.85 49.17,28.85 48.36,29.67 48.36,30.28 IC3.7
  Bottom 0.203: v54.46,28.85 55.88,28.85 58.32,26.42 73.97,26.42 76.81,23.57 ANLGDAISY-MAIN.5 77.01,23.37 78.23,22.15 83.72,22.15 90.83,15.04 90.83,14.02 91.64,13.21 92.66,13.21 93.88,11.99 94.49,11.99 JOYSTICKS.5
A15  (via drill 0.41)
  Top 0.203: v55.68,32.72 53.44,30.48 49.58,30.48 IC3.8
  Bottom 0.203: v55.68,32.72 60.35,32.72 65.84,27.23 77.42,27.23 78.03,26.62 78.03,24.79 79.25,23.57 ANLGDAISY-MAIN.6 79.45,23.37 84.94,23.37 93.67,14.63 94.49,14.63 JOYSTICKS.6
D2  (via drill 0.41)
  Top 0.203: v55.07,18.49 57.1,20.52 59.94,20.52 61.98,22.55 61.98,22.76 U1.9 | v43.69,65.84 44.3,66.45 44.5,66.45 45.31,67.26 45.31,70.92 46.13,71.73 47.75,71.73 48.97,70.51 ENCODER.3 | v57.1,64.21 69.49,64.21 81.28,52.43 81.28,48.97 80.47,48.16 77.42,48.16 72.75,43.48 72.75,43.08 U$23.15
  Bottom 0.203: v55.07,18.49 53.85,18.49 47.55,24.79 46.74,24.79 39.83,31.7 39.83,61.98 v43.69,65.84 | v57.1,64.21 53.44,64.21 50.39,67.26 50.39,69.09 49.17,70.31 ENCODER.3
D2_3.3V  (via drill 0.41)
  Top 0.203: v61.37,23.98 61.37,22.96 U1.10 | v63.2,13.61 64.01,12.8 64.01,10.77 62.79,9.55 B1.P1-18
  Bottom 0.203: v61.37,23.98 61.37,21.34 63.2,19.51 v63.2,13.61
D3  (via drill 0.41)
  Top 0.203: v61.37,18.29 61.37,17.27 U1.7 | v44.7,65.84 46.53,67.67 ENCODER.6 | v56.29,55.27 63.8,47.75 68.68,47.75 71.93,44.5 71.93,43.08 U$23.16
  Bottom 0.203: v61.37,18.29 57.51,18.29 50.6,25.2 46.94,25.2 40.23,31.9 40.23,55.27 | 40.23,55.27 40.23,61.37 v44.7,65.84 | 40.23,55.27 v56.29,55.27
D3_3.3V  (via drill 0.41)
  Top 0.203: v60.76,15.65 60.76,17.07 U1.6 | v61.77,14.22 60.76,14.22 58.93,12.39 58.93,10.77 57.71,9.55 B1.P1-22
  Bottom 0.203: v60.76,15.65 60.76,15.24 v61.77,14.22
D5  (via drill 0.41)
  Top 0.203: v50.8,59.74 63.2,47.35 68.48,47.35 71.32,44.5 71.32,43.08 U$23.17 | v47.75,62.79 47.75,69.29 46.74,70.31 ENCODER.5
  Bottom 0.203: v47.75,62.79 v50.8,59.74
D6  (via drill 0.41)
  Top 0.203: v70.71,44.09 70.71,43.08 U$23.18 | v72.34,45.72 71.93,45.72 69.49,48.16 65.43,48.16 v50.8,62.79
  Bottom 0.203: v72.34,45.72 v70.71,44.09 | v50.8,62.79 50.8,66.04 49.17,67.67 ENCODER.4
D8  (via drill 0.41)
  Top 0.203: v50.8,58.73 62.59,46.94 67.87,46.94 69.9,44.91 69.9,43.08 U$23.19 | v49.58,59.94 49.58,65.63 51.61,67.67 ENCODER.2
  Bottom 0.203: v49.58,59.94 v50.8,58.73
D9  (via drill 0.41)
  Top 0.203: v69.29,40.23 69.29,42.88 U$23.20 | v62.99,57.51 57.1,63.4 56.9,63.4 v54.05,66.24
  Bottom 0.203: v69.29,40.23 67.87,40.23 67.67,40.03 66.85,40.03 62.99,43.89 v62.99,57.51 | v54.05,66.24 52.83,67.46 52.83,69.29 51.82,70.31 ENCODER.1
D22  (via drill 0.41)
  Top 0.203: v22.76,23.77 20.52,23.77 R7.2 | v38.61,7.92 63.8,7.92 65.23,9.35 B1.P1-16
  Bottom 0.203: v38.61,7.92 v22.76,23.77
D23  (via drill 0.41)
  Top 0.203: v27.64,19.91 20.52,19.91 R8.2
  Bottom 0.203: v27.64,19.91 40.64,6.91 79.65,6.91 81.89,9.14 81.89,12.39 81.08,13.21 80.06,13.21 79.25,12.39 79.25,11.58 78.44,10.77 74.98,10.77 74.17,9.96 74.17,9.14 73.36,8.33 71.53,8.33 70.51,9.35 B1.P1-12
EEPROM_CS
  Top 0.203: U7.1 48.16,17.88 48.16,12.39 52.22,8.33 63.2,8.33 64.21,9.35 64.21,10.36 65.23,11.38 65.23,11.99 B1.P1-15
GND  (via drill 0.61)
  Top 0.406: U$20.P$1 5,17 9,13 9,13.54 J1.SHUNT | U$27.P$1 65.2,45.2 66,46 68,46 68,45.05 C3.2
  Top 0.508: GPIO1.1 95.1,58.73 95.1,59.13 96.52,60.55 96.52,67.26 95.1,68.68 GPIO2.1 | U$23.12 73.97,37.19 74.17,37.19 v76,39.01 | JOYSTICKS.8 97.13,14.63 97.13,28.85 94.08,31.9 U$7.P$1 | C5.2 39.01,45.11 39.83,45.11 40.03,44.91 42.27,44.91 43.08,45.72 43.08,46.53 IC2.14 43.28,46.74 43.28,47.75 43.69,48.16 | 49.38,35.56 IC3.9 49.38,35.76 49.38,36.58 48.77,37.19 | 48.77,37.19 43.89,37.19 43.28,36.58 43.28,35.76 IC3.14 43.08,35.56 43.08,34.75 42.27,33.93 39.22,33.93 C4.2 39.01,34.14 39.01,29.87 44.09,24.79 44.09,24.18 C8.2 44.09,23.77 48.77,19.1 52.43,19.1 52.53,19 | 50.39,43.28 50.39,39.01 48.77,37.39 48.77,37.19 | 50.39,43.28 50.39,44.91 49.58,45.72 49.58,46.53 IC2.9 49.38,46.74 49.38,47.55 48.77,48.16 43.69,48.16 | 50.39,43.28 60.15,43.28 61.37,44.5 61.37,45.11 U$27.P$1 | B1.P1-6 77.83,9.35 77.22,9.35 76,8.13 69.09,8.13 67.87,9.35 B1.P1-14 | 54.36,13.51 53.03,12.19 52.63,12.19 B1.P1-25 | 54.36,13.51 55.88,15.04 C11.2 56.08,15.04 57.3,15.04 57.51,14.83 61.16,14.83 63.2,16.87 63.2,17.07 | 52.53,19 51.61,18.09 49.99,18.09 U7.4 49.99,17.88 54.36,13.51 | 52.53,19 55.88,22.35 55.88,23.98 C1.2 | 63.2,17.07 70.1,17.07 70.31,16.87 B1.P5-8 70.51,16.66 70.51,14.43 | 63.2,17.07 62.99,17.07 | 62.99,17.07 61.98,17.07 U1.8 | 62.99,17.07 62.99,23.57 61.98,24.59 61.98,26.01 U3.8 | 70.51,14.43 72.75,12.19 B1.P1-9 | 70.51,14.43 B1.P5-7 | J1.GND 5.69,9.14 5.69,9.55 8.94,12.8 J1.SHUNT 9.14,13.61 11.58,13.61 14.02,16.05 14.22,16.05 | PC2.- 34.95,14.43 23.98,14.43 IC1.1 23.77,14.43 21.95,14.43 19.1,17.27 PC1.- 18.9,17.27 16.66,15.04 15.04,15.04 C2.2 15.04,15.24 14.22,16.05
  Top 0.508: 14.33,20.02 14.22,19.91 14.22,16.05 | 14.33,20.02 15.65,21.34 15.65,21.95 U$15.K1 | 16.56,28.96 14.22,26.62 14.22,20.12 14.33,20.02 | 16.56,28.96 17.88,30.28 17.88,31.7 X2.1 | X1.1 17.88,41.66 17.88,40.23 16.46,38.81 16.46,29.06 16.56,28.96 | RESETA.1 13.21,74.17 15.85,74.17 RESETA1.1 16.05,74.37 16.05,77.22 20.93,82.09 20.93,82.91 U$3.P$1 21.13,83.11 39.83,83.11 U$5.P$1 | 43.69,48.16 43.69,64.62 42.88,65.43 42.88,66.65 43.89,67.67 ENCODER.8 | UART1.5 77.42,49.38 77.01,49.38 75.59,47.95 70.51,47.95 58.32,60.15 57.71,60.15 B1.P6-1
  Bottom 0.406: U$1.P$1 8,67 10.63,69.63 13,72 13,74.32 | 13,75 13,74.32 | 13,74.32 RESETA.1
  Bottom 0.508: 87.68,71.63 94.89,78.84 GPIO3.1 | 87.68,71.63 86.56,70.51 81.48,70.51 SERIAL2.1 | 87.68,71.63 92.05,67.26 93.07,67.26 94.49,68.68 94.89,68.68 GPIO2.1 | UART1.5 77.42,49.38 76,47.95 v76,39.01 86.97,39.01 91.75,34.24 | 91.75,34.24 93.88,32.11 U$7.P$1 | GPIO1.1 94.89,58.52 94.89,57.71 91.85,54.66 91.85,34.34 91.75,34.24 | B1.P1-14 67.67,9.35 66.45,8.13 62.18,8.13 60.96,9.35 60.35,9.35 B1.P1-20 60.15,9.35 59.54,9.35 58.32,8.13 52.02,8.13 51.21,8.94 51.21,10.77 52.43,11.99 B1.P1-25 | SERIAL.1 61.98,70.31 63.4,68.89 63.4,66.04 57.71,60.35 B1.P6-1 57.51,60.35 52.02,60.35 44.09,68.28 ENCODER.8 43.89,67.87 43.89,68.48 40.03,72.34 40.03,82.91 U$5.P$1 | 10.63,69.63 17.88,62.38 17.88,41.86 X1.1
GPA0  (via drill 0.41)
  Top 0.203: v68.68,39.42 68.68,37.19 U$23.4 | v49.17,44.91 48.36,45.72 48.36,46.53 IC2.10
  Bottom 0.203: v68.68,39.42 54.66,39.42 v49.17,44.91
GPA1  (via drill 0.41)
  Top 0.203: v69.29,38.61 69.29,37.19 U$23.5 | v55.88,38.61 54.46,38.61 49.99,34.14 48.97,34.14 48.36,34.75 48.36,35.56 IC3.10
  Bottom 0.203: v55.88,38.61 v69.29,38.61
GPA2  (via drill 0.41)
  Top 0.203: v90.63,49.17 76.4,34.95 71.73,34.95 70.1,36.58 70.1,36.98 U$23.6
  Bottom 0.203: v90.63,49.17 90.63,61.16 92.05,62.59 93.67,62.59 94.89,61.37 GPIO1.3
GPA3  (via drill 0.41)
  Top 0.203: v85.34,48.16 77.83,40.64 73.15,40.64 70.71,38.2 70.71,37.19 U$23.7
  Bottom 0.203: v85.34,48.16 90.63,48.16 91.24,48.77 91.24,59.94 92.46,61.16 GPIO1.4
GPA4
  Top 0.203: U$23.8 71.32,37.19 71.32,37.59 73.97,40.23 78.44,40.23 93.47,55.27 93.47,56.08 94.69,57.3 95.5,57.3 97.13,58.93 97.13,69.29 95.1,71.32 GPIO2.3
GPA5  (via drill 0.41)
  Top 0.203: v95.1,56.69 94.08,55.68 94.08,55.27 78.64,39.83 74.17,39.83 71.93,37.59 71.93,37.19 U$23.9
  Bottom 0.203: v95.1,56.69 96.52,58.12 96.52,69.29 95.71,70.1 93.88,70.1 92.66,71.32 GPIO2.4
GPA6  (via drill 0.41)
  Top 0.203: v96.93,56.49 76.2,35.76 73.36,35.76 72.75,36.37 72.75,36.98 U$23.10
  Bottom 0.203: v96.93,56.49 96.93,79.65 95.1,81.48 GPIO3.3
GPA7  (via drill 0.41)
  Top 0.203: v97.54,58.12 75.59,36.17 73.56,36.17 73.15,36.58 73.15,36.98 U$23.11
  Bottom 0.203: v97.54,58.12 97.54,80.87 95.5,82.91 93.88,82.91 92.66,81.69 GPIO3.4
GPB0  (via drill 0.41)
  Top 0.203: v75.18,41.66 73.97,42.88 U$23.13 | v88.19,23.77 88.19,13.21 89.41,11.99 JOYSTICKS.1
  Bottom 0.203: v75.18,41.66 75.18,36.78 v88.19,23.77
GPB1  (via drill 0.41)
  Top 0.203: v73.36,41.25 73.36,42.88 U$23.14
  Bottom 0.203: v73.36,41.25 73.36,37.59 95.91,15.04 95.91,14.02 95.1,13.21 93.47,13.21 92.25,14.43 JOYSTICKS.4
MISO_3.3V  (via drill 0.41)
  Top 0.203: v57.91,15.65 58.12,15.85 58.12,17.07 U1.2 | U7.2 48.77,17.88 48.77,14.22 52.22,10.77 56.29,10.77 57.51,11.99 B1.P1-21
  Bottom 0.203: v57.91,15.65 57.91,12.39 57.71,12.19 B1.P1-21
MISO_5.0V  (via drill 0.41)
  Top 0.203: v58.73,18.9 58.73,17.27 U1.3 | v48.16,32.51 45.72,34.95 45.72,35.56 IC3.12 | v45.52,44.91 45.52,46.53 IC2.12
  Bottom 0.203: v58.73,18.9 48.16,29.46 v48.16,32.51 48.16,33.33 44.7,36.78 44.7,43.69 45.52,44.5 v45.52,44.91
MOSI_3.3V  (via drill 0.41)
  Top 0.203: v58.12,24.99 58.73,25.6 58.73,26.01 U3.3 | v53.65,24.99 50.8,24.99 49.99,24.18 U7.5 | v62.59,15.04 62.59,14.02 60.76,12.19 60.35,12.19 B1.P1-19
  Bottom 0.203: v53.65,24.99 57.1,24.99 | 57.1,24.99 v58.12,24.99 | v62.59,15.04 62.59,19.51 57.1,24.99
MOSI_5.0V  (via drill 0.41)
  Top 0.203: SERIAL2.8 73.76,67.67 70.71,64.62 58.12,64.62 55.07,67.67 54.25,67.67 SERIAL.8 54.05,67.67 54.05,67.26 50.19,63.4 v50.19,48.36 | v58.12,28.25 58.12,26.21 U3.2 | v49.38,33.12 48.77,33.12 46.94,34.95 46.94,35.56 IC3.11 | v46.74,44.91 46.74,46.53 IC2.11
  Bottom 0.203: v58.12,28.25 58.12,28.65 53.65,33.12 v49.38,33.12 45.11,37.39 45.11,43.48 45.31,43.69 45.52,43.69 v46.74,44.91 v50.19,48.36
N$1
  Top 0.203: U$23.1 66.65,37.19 64.01,37.19 R3.1
N$9
  Top 0.203: SJ2.2 84.53,49.38 82.7,49.38 UART1.9
N$10
  Top 0.203: SJ1.1 84.53,52.02 82.7,52.02 UART1.10
N$17
  Top 0.203: R8.1 18.49,19.91 16.26,19.91 15.85,19.51 U$15.A2
N$22
  Top 0.203: R7.1 18.49,23.98 16.26,23.98 15.85,24.38 U$15.A3
RESET
  Top 0.203: RESETA.3 13.21,79.25 15.85,79.25 RESETA1.3
  Bottom 0.203: B1.P6-2 57.51,57.71 53.85,57.71 45.11,66.45 28.85,66.45 16.05,79.25 RESETA1.3
RXD0_3.3V  (via drill 0.41)
  Top 0.203: v62.18,21.54 60.76,20.12 59.74,20.12 59.33,19.71 59.33,17.27 U1.4
  Bottom 0.203: v62.18,21.54 74.37,21.54 77.83,18.09 78.44,18.09 79.25,17.27 79.25,16.26 78.44,15.44 74.98,15.44 74.17,14.63 74.17,10.77 72.95,9.55 B1.P1-10
RXD0_5.0V  (via drill 0.41)
  Top 0.203: v59.94,19.3 59.94,17.27 U1.5 | v54.86,27.23 v54.86,24.38 | v64.82,44.3 v53.03,32.51 | v66.85,53.65 70.71,53.65 72.34,52.02 UART1.2
  Bottom 0.203: v54.86,24.38 v59.94,19.3 | v54.86,27.23 53.03,29.06 v53.03,32.51 | v64.82,44.3 64.82,51.61 v66.85,53.65
SCL_3.3V  (via drill 0.41)
  Top 0.203: v68.07,77.22 67.06,76.2 R1.1 | v65.63,78.64 64.62,78.64 64.01,78.03 Q2.2 | v91.03,77.22 98.55,69.7 98.55,11.58 97.33,10.36 83.92,10.36 83.52,10.77 79.25,10.77 78.03,11.99 B1.P1-5
  Bottom 0.203: v65.63,78.64 67.06,77.22 v68.07,77.22 v91.03,77.22
SCL_5.0V  (via drill 0.41)
  Top 0.203: 68.07,37.19 67.46,37.19 U$23.2 | U$23.21 68.68,43.08 68.07,43.08 U$23.22 68.07,42.88 68.07,41.86 | 68.07,41.86 68.07,37.19 | 68.07,37.19 U$23.3 | 77.62,69.09 77.62,70.92 76.2,72.34 76.2,76 R9.1 76,76.2 75.18,77.01 75.18,77.22 72.54,79.86 64.21,79.86 62.18,77.83 62.18,77.01 Q2.3 | 77.62,69.09 78.84,67.87 SERIAL2.4 | v68.48,41.86 68.07,41.86 | 77.62,69.09 73.36,69.09 70.1,65.84 61.98,65.84 60.15,67.67 59.33,67.67 SERIAL.4
  Bottom 0.203: v68.48,41.86 68.48,57.3 78.84,67.67 SERIAL2.4
SCLK_3.3V  (via drill 0.41)
  Top 0.203: v54.46,14.83 54.46,18.9 56.9,21.34 56.9,23.57 57.1,23.77 58.12,23.77 59.94,25.6 59.94,26.01 U3.5 | v49.38,21.95 49.38,23.98 U7.6
  Bottom 0.203: B1.P1-23 55.07,12.19 54.46,12.8 v54.46,14.83 49.38,19.91 v49.38,21.95
SCLK_5.0V  (via drill 0.41)
  Top 0.203: v62.59,66.45 69.9,66.45 73.76,70.31 SERIAL2.7 | v59.33,28.04 59.33,26.21 U3.4 | IC2.13 44.5,46.53 44.5,44.91 45.72,43.69 v45.72,43.08 42.88,43.08 42.47,42.67 42.47,40.23 42.06,39.83 v42.06,37.39 | v44.3,33.93 44.3,35.56 IC3.13
  Bottom 0.203: v62.59,66.45 56.29,66.45 55.47,67.26 55.47,68.28 54.25,69.49 54.25,70.31 SERIAL.7 | v59.33,28.04 53.85,33.53 50.6,33.53 45.72,38.41 v45.72,43.08 46.33,43.69 46.53,43.69 73.15,70.31 73.76,70.31 SERIAL2.7 | v44.3,33.93 44.3,35.15 v42.06,37.39
SDA_3.3V  (via drill 0.41)
  Top 0.203: v71.12,76.2 72.95,76.2 R4.1 | v61.16,78.03 60.15,78.03 Q1.2 59.94,77.83 48.56,77.83 38.81,68.07 v38.81,65.84
  Bottom 0.203: v71.12,76.2 62.99,76.2 v61.16,78.03 | v38.81,65.84 38.81,20.52 52.02,7.32 77.62,7.32 79.25,8.94 79.25,9.96 80.47,11.18 80.47,11.99 B1.P1-3
SDA_5.0V  (via drill 0.41)
  Top 0.203: v56.69,76.81 57.91,76.81 Q1.3 | v67.46,41.86 67.46,42.88 U$23.23 | v73.76,72.34 70.1,76 R2.1
  Bottom 0.203: v56.69,76.81 56.69,72.95 59.13,70.51 SERIAL.3 59.33,70.51 59.94,70.51 61.77,72.34 v73.76,72.34 77.01,72.34 78.84,70.51 SERIAL2.3 78.84,70.31 77.62,69.09 77.62,67.26 67.46,57.1 v67.46,41.86
TXD0_3.3V  (via drill 0.41)
  Top 0.203: v61.98,29.46 61.98,31.9 U3.9 | v64.41,27.03 74.37,17.07 74.37,10.57 75.39,9.55 B1.P1-8
  Bottom 0.203: v64.41,27.03 v61.98,29.46
TXD0_5.0V  (via drill 0.41)
  Top 0.203: v62.99,37.19 61.37,35.56 61.37,32.11 U3.10
  Bottom 0.203: v62.99,37.19 68.89,37.19 69.9,38.2 69.9,44.5 74.78,49.38 UART1.3
VIN  (via drill 0.61)
  Top 0.508: IC1.3 23.77,9.55 20.73,9.55 20.32,9.14 D1.C 20.73,9.75 17.68,12.8 17.68,13.01 | 17.88,13.01 18.69,13.01 18.9,12.8 PC1.+ | 17.88,13.01 17.68,13.01 | 17.68,13.01 15.04,13.01 C2.1 | 17.88,13.01 v17.88,14.63
  Bottom 0.508: v17.88,14.63 17.88,28.25 X2.2

### Text on the board
_tsilk: PCB-RPIBO1 | v??-?? | 5V | GND | 5V
_bsilk: GITHUB: SKAARHOJ-Open-Engineering